# EAGLE design Vario 0.1 Ultra Mini (EAGLE 7.3.0)

## Sheet 1 of 2: Alimentation
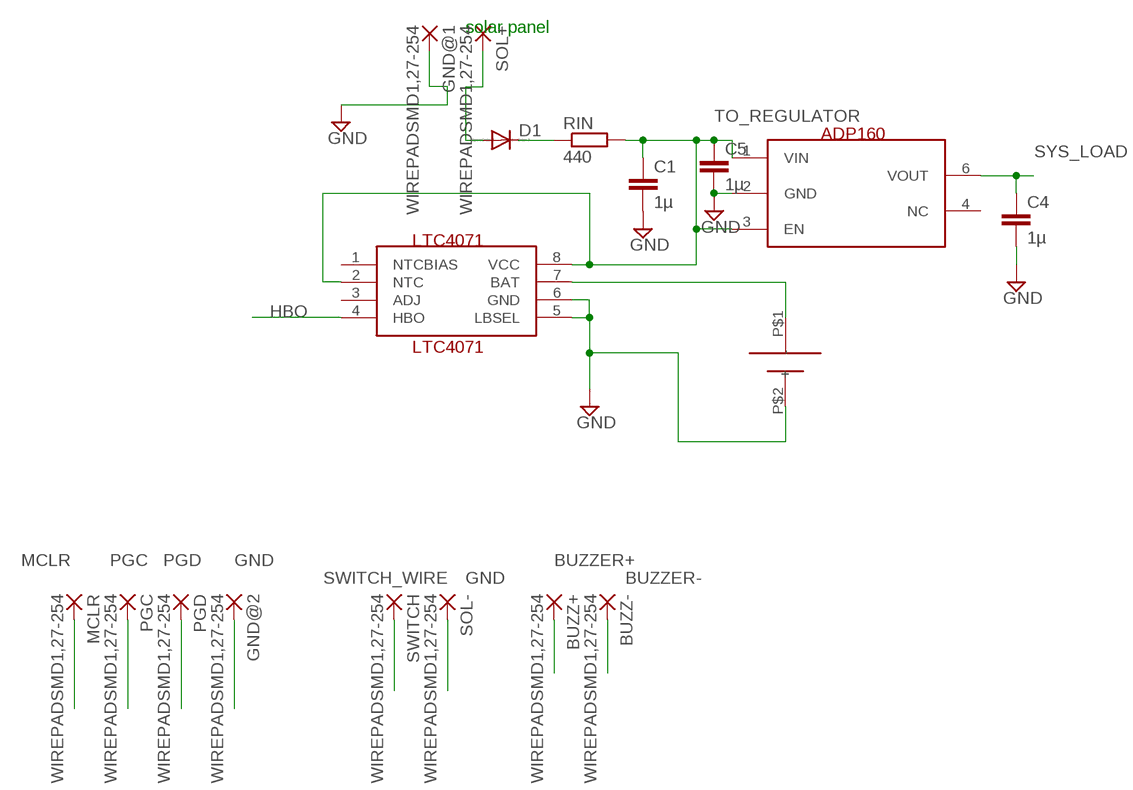
[diagram p0: schematic, sheet 1]

### Parts
ADP160  ADP160/161/162/163  [TSOT23-6_DDC]
BATT+  VARIO_LIPO  [VARIO_LIPO]
BUZZ+  WIREPADSMD1,27-254  [SMD1,27-2,54]
BUZZ-  WIREPADSMD1,27-254  [SMD1,27-2,54]
C1  1µ  C-EUC0603  [C0603]
C4  1µ  C-EUC0603  [C0603]
C5  1µ  C-EUC0603  [C0603]
D1  DIODE-SOD323-R  [SOD323-R]
GND@1  WIREPADSMD1,27-254  [SMD1,27-2,54]
GND@2  WIREPADSMD1,27-254  [SMD1,27-2,54]
LTC4071  LTC4071  [MSOP8]
MCLR  WIREPADSMD1,27-254  [SMD1,27-2,54]
PGC  WIREPADSMD1,27-254  [SMD1,27-2,54]
PGD  WIREPADSMD1,27-254  [SMD1,27-2,54]
RIN  440  R-EU_R0603  [R0603]
SOL+  WIREPADSMD1,27-254  [SMD1,27-2,54]
SOL-  WIREPADSMD1,27-254  [SMD1,27-2,54]
SWITCH  WIREPADSMD1,27-254  [SMD1,27-2,54]

### Nets
BATT: BATT+.P$1(+) LTC4071.7(BAT)
BUZZER+: BUZZ+.1(P) ; also sheet 2
BUZZER-: BUZZ-.1(P) ; also sheet 2
GND: ADP160.2(GND) BATT+.P$2(-) C1.2 C4.2 C5.2 GND@1.1(P) GND@2.1(P) LTC4071.5(LBSEL) LTC4071.6(GND) SOL-.1(P) ; also sheet 2
HBO: LTC4071.4(HBO)
MCLR: MCLR.1(P) ; also sheet 2
N$3: D1.C RIN.1
PGC: PGC.1(P) ; also sheet 2
PGD: PGD.1(P) ; also sheet 2
SOL+: D1.A SOL+.1(P)
SWITCH_WIRE: SWITCH.1(P) ; also sheet 2
SYS_LOAD: ADP160.6(VOUT) C4.1 ; also sheet 2
TO_REGULATOR: ADP160.1(VIN) ADP160.3(EN) C1.1 C5.1 LTC4071.2(NTC) LTC4071.8(VCC) RIN.2
Unconnected: ADP160.4(NC) LTC4071.1(NTCBIAS) LTC4071.3(ADJ)

### Notes on the sheet
- solar panel

## Sheet 2 of 2: Vario Core
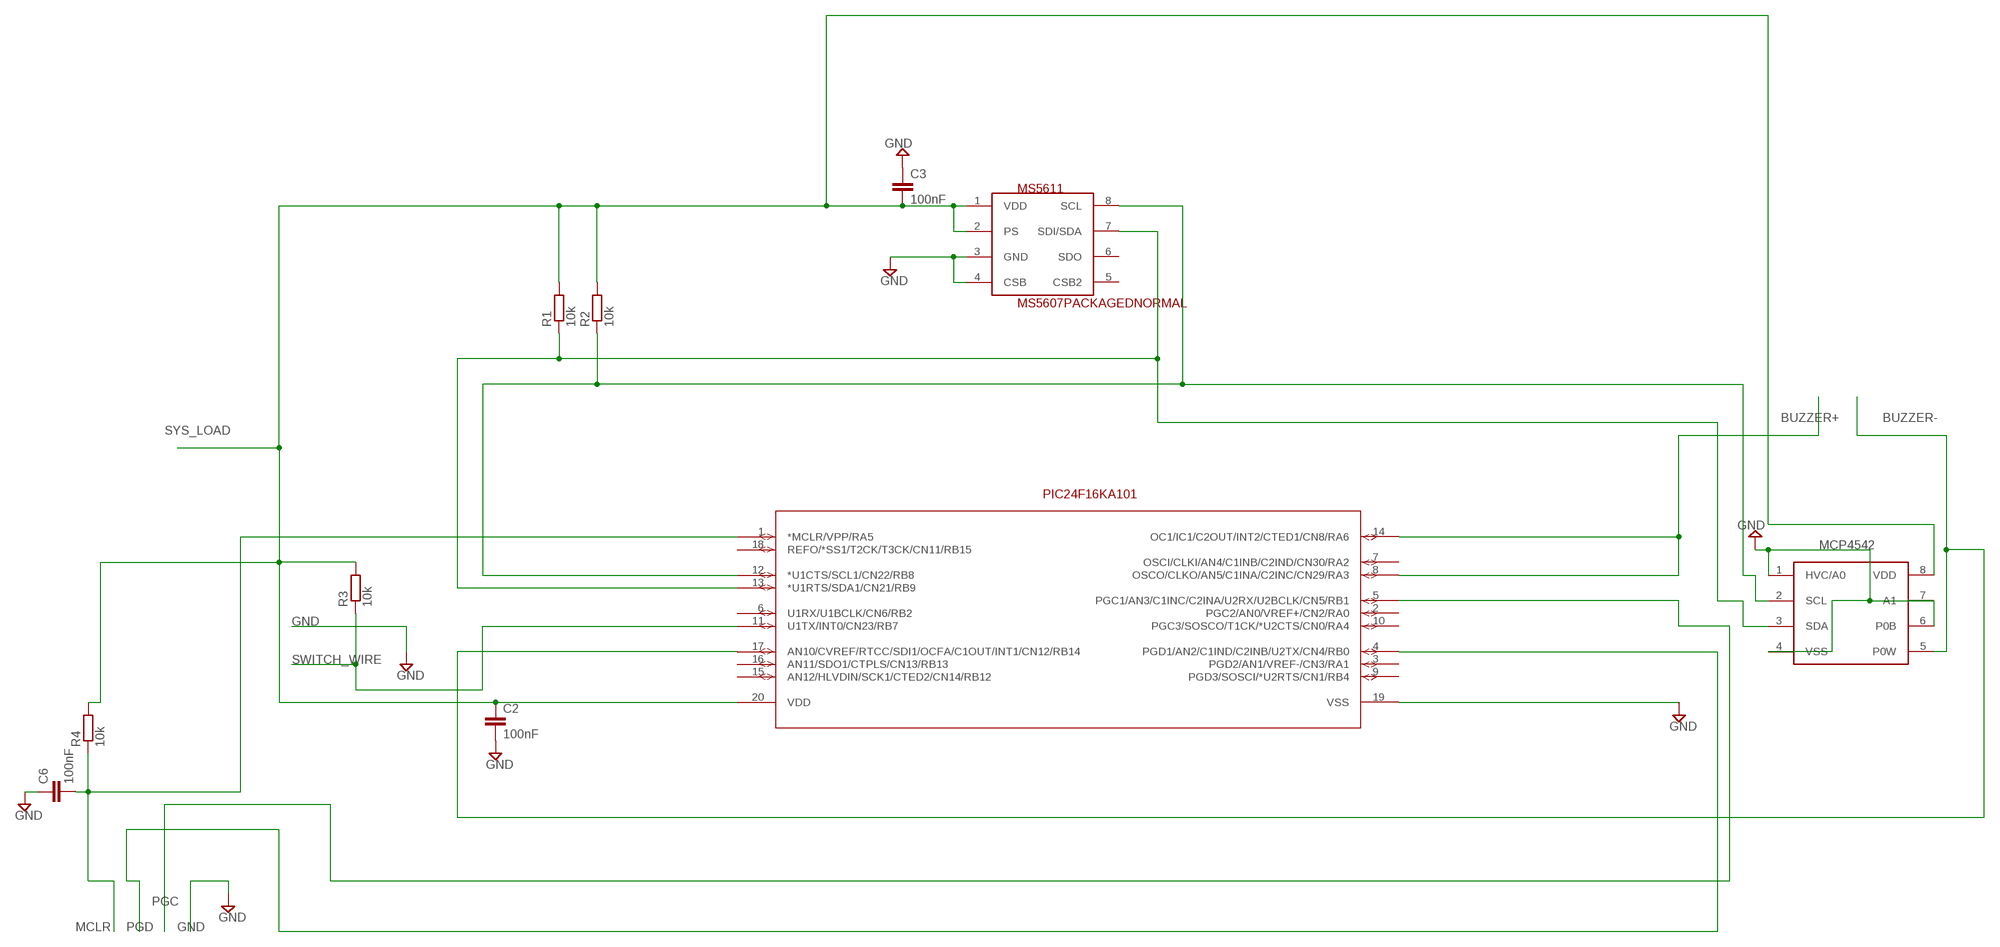
[diagram p1: schematic, sheet 2]

### Parts
C2  100nF  C-EUC0603  [C0603]
C3  100nF  C-EUC0603  [C0603]
C6  100nF  C-EUC0603  [C0603]
MCP4542  MCP4542  [MSOP8]
MS5611  MS5607PACKAGEDNORMAL  [MS5607-02BA03]
PIC24F16KA101  PIC24F16KA101-X_  [SSOP20_MC]
R1  10k  R-EU_R0603  [R0603]
R2  10k  R-EU_R0603  [R0603]
R3  10k  R-EU_R0603  [R0603]
R4  10k  R-EU_R0603  [R0603]

### Nets
BUZZER+: PIC24F16KA101.8(OSCO/CLKO/AN5/C1INA/C2INC/CN29/RA3) PIC24F16KA101.14(OC1/IC1/C2OUT/INT2/CTED1/CN8/RA6) ; also sheet 1
BUZZER-: MCP4542.5(P0W) PIC24F16KA101.17(AN10/CVREF/RTCC/SDI1/OCFA/C1OUT/INT1/CN12/RB14) ; also sheet 1
GND: C2.2 C3.1 C6.1 MCP4542.1(HVC/A0) MCP4542.4(VSS) MCP4542.6(P0B) MCP4542.7(A1) MS5611.3(GND) MS5611.4(CSB) PIC24F16KA101.19(VSS) ; also sheet 1
MCLR: C6.2 PIC24F16KA101.1(*MCLR/VPP/RA5) R4.1 ; also sheet 1
PGC: PIC24F16KA101.5(PGC1/AN3/C1INC/C2INA/U2RX/U2BCLK/CN5/RB1) ; also sheet 1
PGD: PIC24F16KA101.4(PGD1/AN2/C1IND/C2INB/U2TX/CN4/RB0) ; also sheet 1
SCL: MCP4542.2(SCL) MS5611.8(SCL) PIC24F16KA101.12(*U1CTS/SCL1/CN22/RB8) R2.1
SDA: MCP4542.3(SDA) MS5611.7(SDI/SDA) PIC24F16KA101.13(*U1RTS/SDA1/CN21/RB9) R1.1
SWITCH_WIRE: PIC24F16KA101.11(U1TX/INT0/CN23/RB7) R3.1 ; also sheet 1
SYS_LOAD: C2.1 C3.2 MCP4542.8(VDD) MS5611.1(VDD) MS5611.2(PS) PIC24F16KA101.20(VDD) R1.2 R2.2 R3.2 R4.2 ; also sheet 1
Unconnected: MS5611.5(CSB2) MS5611.6(SDO) PIC24F16KA101.2(PGC2/AN0/VREF+/CN2/RA0) PIC24F16KA101.3(PGD2/AN1/VREF-/CN3/RA1) PIC24F16KA101.6(U1RX/U1BCLK/CN6/RB2) PIC24F16KA101.7(OSCI/CLKI/AN4/C1INB/C2IND/CN30/RA2) PIC24F16KA101.9(PGD3/SOSCI/*U2RTS/CN1/RB4) PIC24F16KA101.10(PGC3/SOSCO/T1CK/*U2CTS/CN0/RA4) PIC24F16KA101.15(AN12/HLVDIN/SCK1/CTED2/CN14/RB12) PIC24F16KA101.16(AN11/SDO1/CTPLS/CN13/RB13) PIC24F16KA101.18(REFO/*SS1/T2CK/T3CK/CN11/RB15)

## Library data of the parts
ADP160 = analog-devices:ADP160/161/162/163: LDO, low Iq Linear Voltage Regulator
BATT+ = battery:VARIO_LIPO
BUZZ+ BUZZ- GND@1 GND@2 MCLR PGC PGD SOL+ SOL- SWITCH = wirepad:WIREPAD: Wire PAD connect wire on PCB
C1-C6 = rcl:C-EU: CAPACITOR, European symbol
D1 = diode:DIODE-: DIODE
LTC4071 = linear-technology:LTC4071
MCP4542 = microchip:MCP4542: Single I2C Rheostat
MS5611 = measurement_specialties:MS5607PACKAGED
PIC24F16KA101 = microchip:PIC24F16KA101-X_
R1-R4 RIN = rcl:R-EU_: RESISTOR, European symbol

## Board
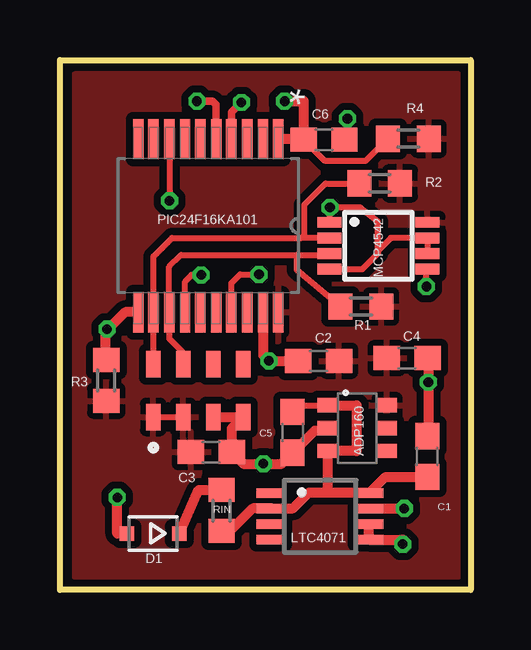
[diagram p2: board, top side]
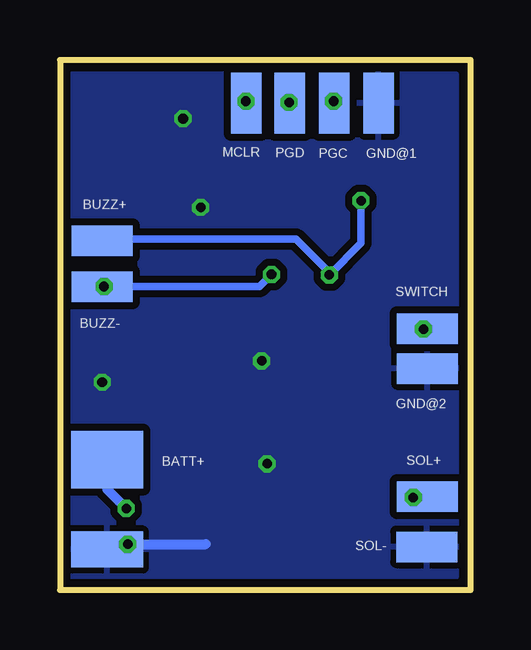
[diagram p3: board, bottom side, seen from below]

Size 17.13 x 22.1 mm. Coordinates in mm from the lower left corner, seen from the top.
Outline: 0,22.1 17.12,22.1 17.12,0 0,0 0,22.1
Copper layers (1*16): Top 0.035mm / dielectric 1.5mm / Bottom 0.035mm
Design rules "default": minimum track width 6mil, minimum drill 12mil, track to track 6mil, track to pad 6mil, pad to pad 6mil, via to via 6mil, smd to smd 0mil, copper to edge 10mil, drill to drill 10mil, minimum pad ring 10mil, minimum via ring 6mil, stop-mask expansion 2mil, vias tented up to drill 100mil, thermal gap 10mil

### Footprints (pad centres in the part's own frame; a part is rotated, then mirrored left to right if it is on the bottom)
TSOT23-6_DDC = smd 0.6 x 0.8: 1 -0.95,-1.25; 2 0,-1.25; 3 0.95,-1.25; 4 0.95,1.25; 5 0,1.25; 6 -0.95,1.25
VARIO_LIPO = smd 3 x 2.4: P$1 0,2 | smd 3 x 1.5: P$2 0,-1.75
SMD1,27-2,54 = smd 1.27 x 2.54: 1 0,0
C0603 = smd 1.1 x 1: 1 -0.85,0; 2 0.85,0
SOD323-R = smd 0.6 x 0.6: A 1.1,0; C -1.1,0
MSOP8 = smd 0.4 x 1.2: 1 -0.975,-2.05; 2 -0.325,-2.05; 3 0.325,-2.05; 4 0.975,-2.05; 5 0.975,2.05; 6 0.325,2.05; 7 -0.325,2.05; 8 -0.975,2.05
MSOP8' = smd 0.45 x 1: 1 -0.975,-2.05; 2 -0.325,-2.05; 3 0.325,-2.05; 4 0.975,-2.05; 5 0.975,2.05; 6 0.325,2.05; 7 -0.325,2.05; 8 -0.975,2.05
MS5607-02BA03 = smd 1.1 x 0.6: 1 0,0; 2 0,-1.25; 3 0,-2.5; 4 0,-3.75; 5 2.2,-3.75; 6 2.2,-2.5; 7 2.2,-1.25; 8 2.2,0
SSOP20_MC = smd 1.676 x 0.432: 1 -3.607,2.921; 2 -3.607,2.286; 3 -3.607,1.626; 4 -3.607,0.965; 5 -3.607,0.33; 6 -3.607,-0.33; 7 -3.607,-0.965; 8 -3.607,-1.626; 9 -3.607,-2.286; 10 -3.607,-2.921; 11 3.607,-2.921; 12 3.607,-2.286; 13 3.607,-1.626; 14 3.607,-0.965; 15 3.607,-0.33; 16 3.607,0.33; 17 3.607,0.965; 18 3.607,1.626; 19 3.607,2.286; 20 3.607,2.921
R0603 = smd 1 x 1.1: 1 -0.85,0; 2 0.85,0

### Placement (x,y rotation side)
ADP160  12.4,6.74 270 top
BATT+  15.16,3.44 0 bottom
BUZZ+  15.37,14.56 90 bottom
BUZZ-  15.37,12.63 90 bottom
C1  15.33,5.56 90 top
C2  10.79,9.55 180 top
C3  6.31,5.75 180 top
C4  14.48,9.66 0 top
C5  9.71,6.57 270 top
C6  11.01,18.77 180 top
D1  3.89,2.36 180 top
GND@1  3.83,20.3 0 bottom
GND@2  1.8,9.23 270 bottom
LTC4071  10.84,3.07 270 top
MCLR  9.35,20.3 0 bottom
MCP4542  MCP4542  [MSOP8']  13.28,14.35 270 top
MS5611  3.89,7.21 90 top
PGC  5.69,20.3 0 bottom
PGD  7.54,20.3 0 bottom
PIC24F16KA101  6.18,15.19 270 top
R1  12.55,11.82 0 top
R2  13.33,16.95 0 top
R3  1.93,8.74 270 top
R4  14.53,18.81 0 top
RIN  6.74,3.31 270 top
SOL+  1.8,3.89 270 bottom
SOL-  1.83,1.79 270 bottom
SWITCH  1.8,10.88 270 bottom

### Tracks (layer width: path | path; a pad name or v marks a point on that pad's centre or on a via)
BATT  (via drill 0.4)
  Top 0.406: LTC4071.7 v14.36,3.39
  Bottom 0.305: 15.14,5.41 BATT+.P$1
  Bottom 0.406: v14.36,3.39 15.14,4.17 15.14,5.41
BUZZER+  (via drill 0.4)
  Top 0.254: PIC24F16KA101.14 5.22,12.87 5.49,13.13 v5.89,13.13 | PIC24F16KA101.8 v4.57,16.23
  Bottom 0.305: v4.57,16.23 4.57,14.45 v5.89,13.13 5.89,13.24 7.29,14.64 15.42,14.64 BUZZ+.1
BUZZER-  (via drill 0.4)
  Top 0.254: PIC24F16KA101.17 7.15,12.79 7.52,13.16 v8.3,13.16 | MCP4542.5 15.26,13.31 v15.29,12.65
  Bottom 0.254: 8.29,13.15 v8.29,13.16 v8.3,13.16 8.28,13.16
  Bottom 0.305: v8.3,13.16 8.81,12.65 v15.29,12.65 15.45,12.65 BUZZ-.1
GND  (via drill 0.4)
  Top 0.254: ADP160.2 11.15,6.75 11.15,6.76 | MCP4542.6 MCP4542.7 13.8,14.68 13.26,14.14 | MCP4542.4 12.61,13.38 13.26,14.02 13.26,14.14 | MCP4542.1 11.26,15.35 v11.26,15.95 12.52,15.95 13.26,15.37 13.26,14.14 | C6.1 11.99,18.9 v11.99,19.65
  Top 0.406: C3.1 7.65,5.26 v8.48,5.26 9.24,5.26 C5.2 10.62,6.63 ADP160.2 | 7.08,5.75 C3.1 | MS5611.3 MS5611.4 7.16,6.73 C3.1 | 9.55,9.53 C2.2 v8.71,9.55 8.47,9.79 PIC24F16KA101.19 | C4.2 15.37,9.46 v15.37,8.66 15.37,6.45 C1.2 | v14.3,1.9 14.3,2.09 LTC4071.5 LTC4071.6
  Bottom 0.406: v14.3,1.9 11.05,1.9
  pour Bottom (isolate 0.3): 0.61,0.56 16.64,0.56 16.64,21.5 0.61,21.5
MCLR  (via drill 0.4)
  Top 0.254: R4.1 12.75,17.88 11.06,17.88 C6.2
  Top 0.305: 10.14,18.79 9.93,19.01
  Top 0.406: PIC24F16KA101.1 10.14,18.79 C6.2 10.16,20.38 v9.37,20.38
  Bottom 0.305: MCLR.1 v9.37,20.38
N$3
  Top 0.406: D1.C 5.79,4.16 RIN.1
PGC  (via drill 0.4)
  Top 0.305: PIC24F16KA101.5 6.51,20.24 6.37,20.38 v5.71,20.38
  Bottom 0.305: v5.71,20.38 PGC.1
PGD  (via drill 0.4)
  Top 0.305: v7.57,20.33 7.15,19.91 PIC24F16KA101.4
  Bottom 0.305: PGD.1 v7.57,20.33
SCL
  Top 0.254: MS5611.8 PIC24F16KA101.12 3.9,13.91 4.67,14.68 10.08,14.68 | MCP4542.2 10.08,14.68 | 10.08,14.68 10.18,14.78 10.18,16.05 11.08,16.95 R2.1
SDA
  Top 0.254: MS5611.7 5.14,9.89 4.56,10.48 PIC24F16KA101.13 4.56,13.48 5.05,13.97 9.88,13.97 | 9.88,13.97 11.18,13.97 MCP4542.3 | R1.1 9.88,13.34 9.88,13.97
SOL+  (via drill 0.4)
  Top 0.406: D1.A 2.39,2.36 v2.39,3.85
  Bottom 0.406: 2.57,4.03 v2.39,3.85 v2.39,3.84 SOL+.1
SWITCH_WIRE  (via drill 0.4)
  Top 0.305: 1.89,10.75 1.97,10.83 v1.97,10.87
  Top 0.406: PIC24F16KA101.11 2.72,11.58 1.89,10.75 1.89,9.63 R3.1
  Bottom 0.305: SWITCH.1 1.78,10.87 v1.97,10.87
SYS_LOAD
  Top 0.254: MS5611.1 MS5611.2
  pour Top (isolate 0.3): 0.61,21.5 0.61,0.56 16.64,0.56 16.64,21.5
TO_REGULATOR
  Top 0.254: C5.1 9.79,7.7 ADP160.1 | ADP160.1 | ADP160.1 11.17,7.7 | LTC4071.8 12.91,4.04 12.93,4.06
  Top 0.406: ADP160.1 12.37,7.69 12.37,5.79 ADP160.3 11.15,4.06 | 11.15,4.06 10.39,4.06 9.73,3.4 8.8,3.4 LTC4071.2 8.03,3.39 7.1,2.46 RIN.2 | 11.15,4.06 12.93,4.06 13.57,4.71 C1.1